# EAGLE design 180221_touchcircuit-2x1011 (EAGLE 8.5.1)
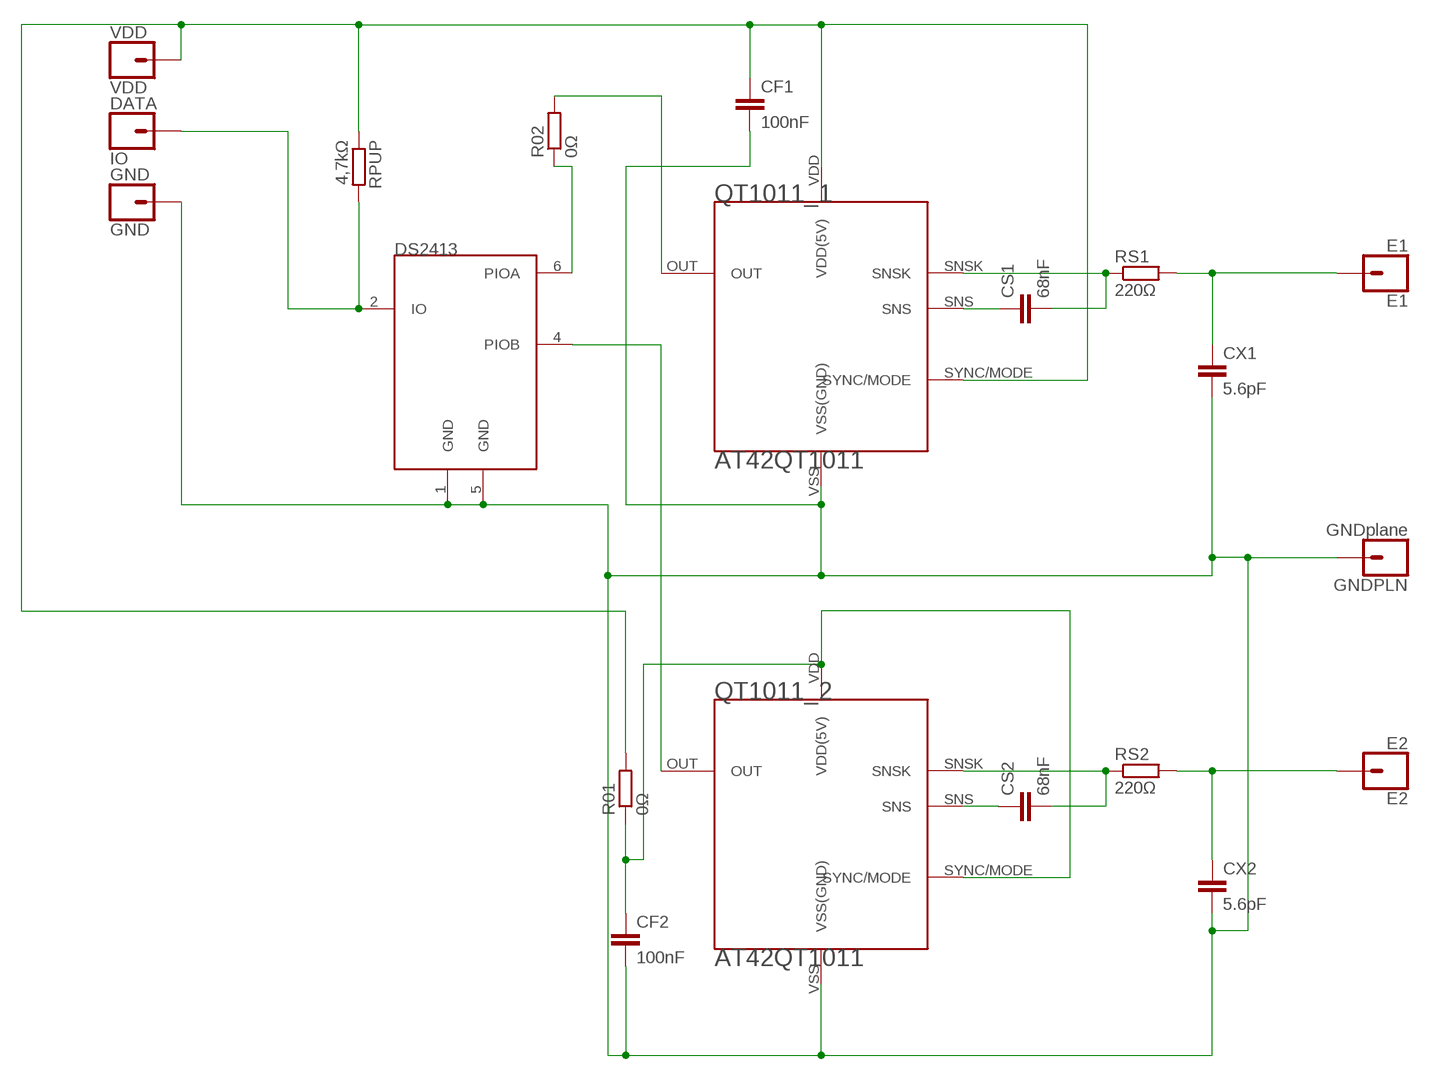
[diagram p0: schematic, sheet 1]

## Parts
CF1  100nF  CC1206  [C1206]
CF2  100nF  CC1206  [C1206]
CS1  68nF  CC1206  [C1206]
CS2  68nF  CC1206  [C1206]
CX1  5.6pF  CC1206  [C1206]
CX2  5.6pF  CC1206  [C1206]
DATA  IO  CONN_01  [1X01]
DS2413  DS2413(TSOC6)  [TSOC6]
E1  E1  CONN_01  [1X01]
E2  E2  CONN_01  [1X01]
GND  GND  CONN_01  [1X01]
GNDPLN  GNDplane  CONN_01  [1X01]
QT1011_1  AT42QT1011  [AT42QT1011]
QT1011_2  AT42QT1011  [AT42QT1011]
R01  0Ω  RR1206  [R1206]
R02  0Ω  RR1206  [R1206]
RPUP  4,7kΩ  RR1206  [R1206]
RS1  220Ω  RR1206  [R1206]
RS2  220Ω  RR1206  [R1206]
VDD  VDD  CONN_01  [1X01]

## Nets
E1: CX1.1 E1.1 RS1.2
E2: CX2.1 E2.1 RS2.2
GND: CF1.2 CF2.2 CX1.2 CX2.2 DS2413.1(GND) DS2413.5(GND) GND.1 GNDPLN.1 QT1011_1.VSS(VSS(GND)) QT1011_2.VSS(VSS(GND))
N$1: CS1.1 QT1011_1.SNS
N$2: DS2413.4(PIOB) QT1011_2.OUT
N$3: DS2413.6(PIOA) R02.1
N$4: QT1011_1.OUT R02.2
N$11: CS2.2 QT1011_2.SNSK RS2.1
N$18: CS2.1 QT1011_2.SNS
N$20: DATA.1 DS2413.2(IO) RPUP.2
SNSK1: CS1.2 QT1011_1.SNSK RS1.1
VDD: CF1.1 QT1011_1.SYNC/MODE QT1011_1.VDD(VDD(5V)) R01.2 RPUP.1 VDD.1
VDD-R0: CF2.1 QT1011_2.SYNC/MODE QT1011_2.VDD(VDD(5V)) R01.1

## Library data of the parts
CF1 CF2 CS1 CS2 CX1 CX2 = eagle-ltspice:C: CAPACITOR, European symbol; SPICEMODEL: NONE; SPICEPREFIX: C
DATA E1 E2 GND GNDPLN VDD = SparkFun-Connectors:CONN_01: Single connection point. Often used as Generic Header-pin footprint for 0.1 inch spaced/style header connections On any of the 0.1 inch spaced packages, you can populate with these: Break Away Headers - Straight <https://www.sparkfun.com/products/116> (PRT-00116) Break Away Male Headers - Right Angle <https://www.sparkfun.com/products/553> (PRT-00553) Female Headers <https://www.sparkfun.com/products/115> (PRT-00115) Break Away Headers - Machine Pin <https://www.sparkfun.com/products/117> (PRT-00117) Break Away Female Headers - Swiss Machine Pin <https://www.sparkfun.com/products/743> (PRT-00743) This device is also useful as a general connection point to wire up your design to another part of your project. Our various solder wires solder well into these plated through hole pads. Hook-Up Wire - Assortment (Stranded, 22 AWG) <https://www.sparkfun.com/products/11375> (PRT-11375) Hook-Up Wire - Assortment (Solid Core, 22 AWG) <https://www.sparkfun.com/products/11367> (PRT-11367) View the entire wire category on our website here <https://www.sparkfun.com/categories/141> Special notes: SMTSO-256-ET is a "flush mount" nut for a 4-40 screw. We mostly use this on specialty testbeds; it is a nice way to connect hardware to your PCB at an adjustable hieght. Also note, the SNAP packages are for using a snappable style connector. We sell a baggie of snaps and they are also used on two LilyPad designs: Snap Assortment - 30 pack (male and female) <https://www.sparkfun.com/products/11347> (DEV-11347) LilyPad Arduino SimpleSnap <https://www.sparkfun.com/products/10941> (DEV-10941) LilyPad SimpleSnap Protoboard <https://www.sparkfun.com/products/10940> (DEV-10940)
DS2413 = Christians_Library:DS2413(TSOC6)
QT1011_1 QT1011_2 = Christians_Library:AT42QT1011
R01 R02 RPUP RS1 RS2 = eagle-ltspice:R: RESISTOR, European symbol; SPICEMODEL: NONE; SPICEPREFIX: R

## Board
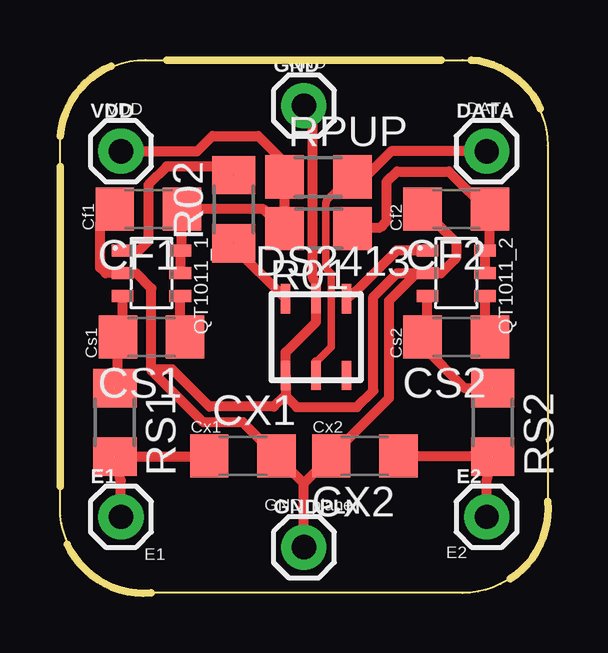
[diagram p1: board, top side]

Size 20.32 x 22.22 mm. Coordinates in mm from the lower left corner, seen from the top.
Outline: 16.76,22.22 arc-90 20.32,18.67 20.32,3.56 arc-90 16.76,0 3.56,0 arc-90 0,3.56 0,18.67 arc-90 3.56,22.22 16.76,22.22
Copper layers (1*16): Top 0.035mm / dielectric 1.5mm / Bottom 0.035mm
Design rules "default *": minimum track width 6mil, minimum drill 0.35mm, track to track 6mil, track to pad 6mil, pad to pad 6mil, via to via 6mil, smd to smd 6mil, copper to edge 40mil, drill to drill 5mil, minimum pad ring 10mil, minimum via ring 8mil, stop-mask expansion 4mil, vias tented up to drill 0mil, thermal gap 10mil
Milling: 6 lines

### Footprints (pad centres in the part's own frame; a part is rotated, then mirrored left to right if it is on the bottom)
C1206 = smd 1.6 x 1.8: 1 -1.4,0; 2 1.4,0
1X01 = drill 1.016 pad 1.88: 1 0,0
TSOC6 = smd 0.406 x 1.219: 1 -1.27,-1.6; 2 0,-1.6; 3 1.27,-1.6; 4 1.27,1.6; 5 0,1.6; 6 -1.27,1.6
AT42QT1011 = smd 0.5 x 0.9: OUT -0.95,-1.2; SNS 0.95,1.2; SNSK 0.95,-1.2; SYNC/MODE -0.95,1.2; VDD 0,1.2; VSS 0,-1.2
R1206 = smd 1.6 x 1.803: 1 -1.422,0; 2 1.422,0

### Placement (x,y rotation side)
CF1  3.68,16 180 top
CF2  16.51,16 180 top
CS1  3.81,10.67 180 top
CS2  16.51,10.67 180 top
CX1  7.62,5.71 0 top
CX2  12.7,5.71 180 top
DATA  17.78,18.41 0 top
DS2413  10.67,10.67 0 top
E1  2.54,3.17 0 top
E2  17.78,3.17 0 top
GND  10.16,20.32 0 top
GNDPLN  10.16,1.9 0 top
QT1011_1  3.81,13.33 270 top
QT1011_2  16.51,13.33 270 top
R01  10.77,15.19 180 top
R02  7.24,16 90 top
RPUP  10.77,17.35 0 top
RS1  2.29,7.11 270 top
RS2  18.03,7.11 270 top
VDD  2.54,18.41 0 top

### Tracks (layer width: path | path; a pad name or v marks a point on that pad's centre or on a via)
E1  (1 unrouted)
  Top 0.406: E1.1 2.54,4.67 RS1.2 6.2,5.69 CX1.1
E2  (1 unrouted)
  Top 0.406: E2.1 17.78,4.67 RS2.2 14.12,5.69 CX2.1
GND
  Top 0.406: 2.54,13.33 QT1011_1.VSS | 10.16,4.57 CX1.2 7.62,7.11 5.97,7.11 3.81,9.27 | GNDPLN.1 10.16,4.57 | 10.16,4.57 CX2.2 13.72,8.13 13.72,12.19 14.86,13.33 QT1011_2.VSS | QT1011_1.VSS 3.18,13.33 3.81,12.7 3.81,9.27 | CF2.2 16.51,14.6 16.51,13.97 15.88,13.33 QT1011_2.VSS | 9.4,8.25 DS2413.1 9.4,10.03 10.67,11.3 DS2413.5 10.67,12.93 10.54,13.13 10.54,20.01 GND.1 | 9.4,8.25 9.4,8.2 9.86,7.75 12.37,7.75 13.06,8.43 13.06,12.34 14.05,13.33 QT1011_2.VSS | 3.81,9.27 3.86,9.32 4.67,9.32 6.22,7.77 8.91,7.77 9.4,8.25 | QT1011_1.VSS 1.91,13.33 1.68,13.56 1.68,15.39 CF1.2
N$1
  Top 0.406: CS1.1 5.01,10.87 QT1011_1.SNS
N$2
  Top 0.406: QT1011_2.OUT 14.03,14.28 12.32,12.57 DS2413.4
N$3  (1 unrouted)
  Top 0.406: DS2413.6 7.24,14.43 R02.1
N$4  (1 unrouted)
  Top 0.406: R02.2 6.88,17.78 4.45,17.78 3.68,17.02 3.68,14.68 3.29,14.28 QT1011_1.OUT
N$11  (1 unrouted)
  Top 0.406: QT1011_2.SNSK 15.31,10.87 CS2.2 15.11,10.29 16.87,8.53 RS2.1
N$18
  Top 0.406: CS2.1 17.71,10.87 QT1011_2.SNS
N$20
  Top 0.305: 10.67,9.63 11.3,10.26 11.3,13.31 11.07,13.54 11.07,16.21 arc-45 11.16,16.42 11.56,16.81 arc45 11.73,16.89 RPUP.2
  Top 0.406: DATA.1 13.79,18.41 12.73,17.35 RPUP.2 | DS2413.2 10.67,9.63
SNSK1  (1 unrouted)
  Top 0.406: RS1.1 2.41,8.66 CS1.2 2.61,10.87 QT1011_1.SNSK
VDD
  Top 0.406: QT1011_1.VDD QT1011_1.SYNC/MODE 5.08,14.36 CF1.1 8.48,16 R01.2 RPUP.1 9.35,17.96 8.26,19.05 6.35,19.05 5.72,18.41 VDD.1
VDD-R0
  Top 0.406: QT1011_2.VDD QT1011_2.SYNC/MODE 17.91,14.48 17.91,15.88 | 17.91,15.88 CF2.1 17.91,16.28 | R01.1 12.24,15.24 13.34,15.24 13.61,15.52 13.61,17.14 14.05,17.58 16.21,17.58 17.91,15.88

### Text on the board
tNames: GND | VDD | DATA | Cf1 | Cf2 | Cs1 | Cs2 | Cx1 | Cx2 | GND plane | E1 | E2
t-screenprint: DS2413 / QT1011 | One Wire - / Touch Controller v1.1 | R0 | Rpup | GND | VDD | DATA | Cf1 | Cf2 | R0 | QT1011_1 | QT1011_2 | DS2413 | Cx1 | Cx2 | Rs1 | E1 | Rs2 | E2 | GND / plane | © Christian Pflug | 2018/03/07